# EAGLE design sensor (EAGLE 5.03)
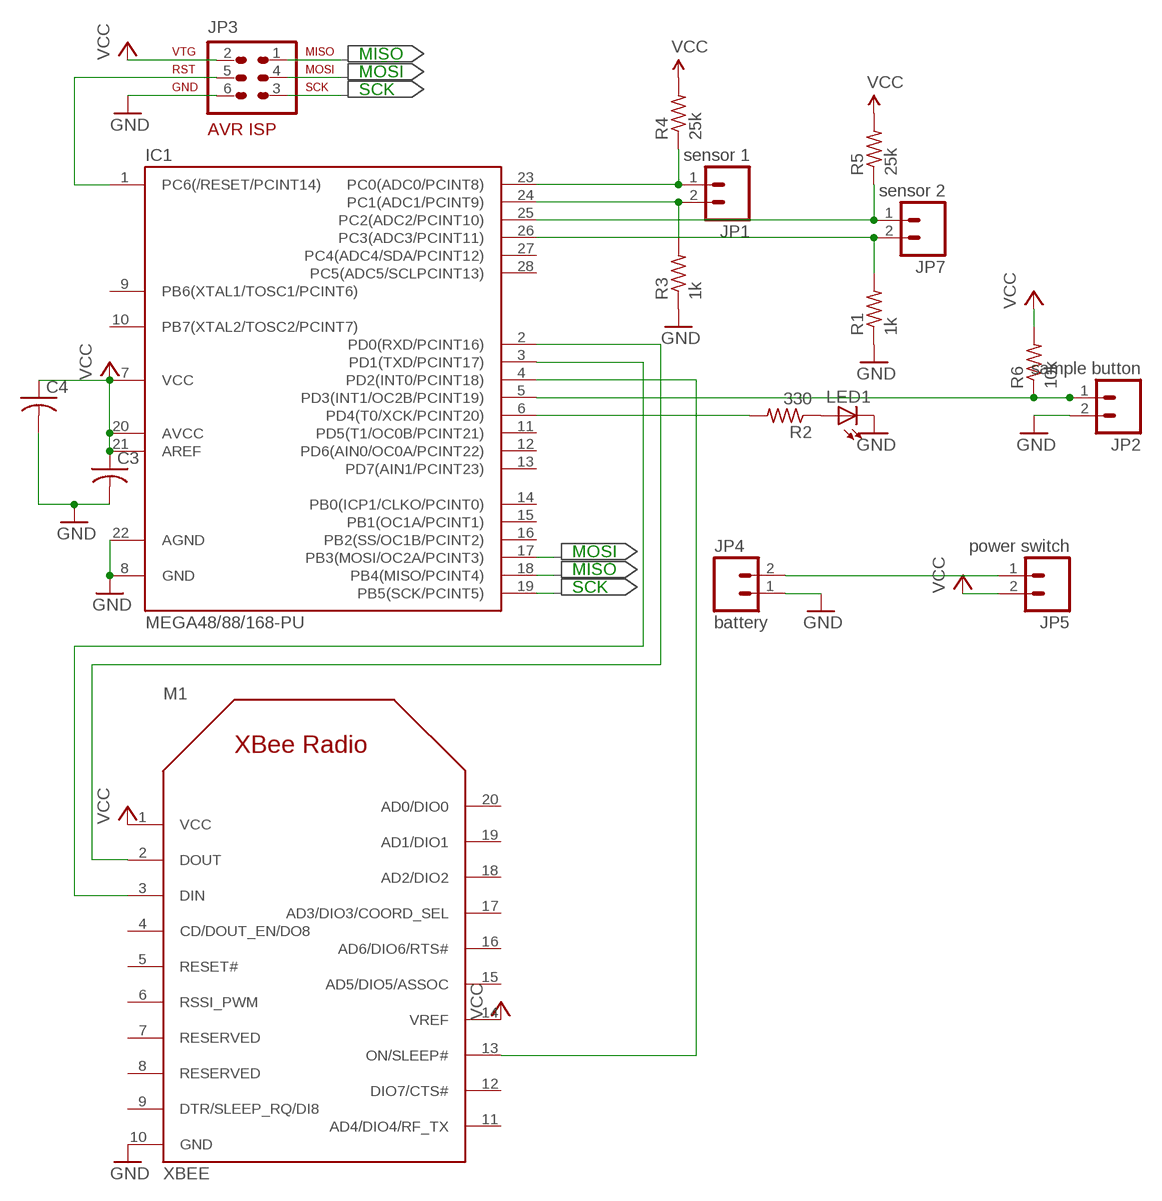
[diagram p0: schematic, sheet 1]

## Parts
C3  C-US025-024X044  [C025-024X044]
C4  C-US025-024X044  [C025-024X044]
IC1  MEGA48/88/168-PU  [DIL28-3]
JP1  sensor 1  M02POLAR  [MOLEX-1X2]
JP2  sample button  M02POLAR  [MOLEX-1X2]
JP3  AVR-ISP-6  [AVR-ISP-6]
JP4  battery  M02POLAR  [MOLEX-1X2]
JP5  power switch  M02POLAR  [MOLEX-1X2]
JP7  sensor 2  M02POLAR  [MOLEX-1X2]
LED1  LED3MM  [LED3MM]
M1  XBEE  [XBEE]
R1  1k  R-US_0204/5  [0204/5]
R2  330  R-US_0204/5  [0204/5]
R3  1k  R-US_0204/5  [0204/5]
R4  25k  R-US_0204/5  [0204/5]
R5  25k  R-US_0204/5  [0204/5]
R6  10k  R-US_0204/5  [0204/5]

## Nets
GND: C3.2 C4.2 IC1.8(GND) IC1.22(AGND) JP2.2 JP3.6 JP4.1 LED1.K(C) M1.10(GND) R1.1 R3.1
MISO: IC1.18(PB4(MISO/PCINT4)) JP3.1
MOSI: IC1.17(PB3(MOSI/OC2A/PCINT3)) JP3.4
N$1: IC1.26(PC3(ADC3/PCINT11)) JP7.2 R1.2
N$2: LED1.A R2.1
N$3: JP4.2 JP5.1
N$4: IC1.24(PC1(ADC1/PCINT9)) JP1.2 R3.2
N$5: IC1.1(PC6(/RESET/PCINT14)) JP3.5
N$6: IC1.2(PD0(RXD/PCINT16)) M1.2(DOUT)
N$7: IC1.3(PD1(TXD/PCINT17)) M1.3(DIN)
N$8: IC1.23(PC0(ADC0/PCINT8)) JP1.1 R4.1
N$9: IC1.25(PC2(ADC2/PCINT10)) JP7.1 R5.1
N$10: IC1.4(PD2(INT0/PCINT18)) M1.13(ON/SLEEP#)
N$11: IC1.5(PD3(INT1/OC2B/PCINT19)) JP2.1 R6.1
N$12: IC1.6(PD4(T0/XCK/PCINT20)) R2.2
SCK: IC1.19(PB5(SCK/PCINT5)) JP3.3
VCC: C3.1 C4.1 IC1.7(VCC) IC1.20(AVCC) IC1.21(AREF) JP3.2 JP5.2 M1.1(VCC) M1.14(VREF) R4.2 R5.2 R6.2
Unconnected: IC1.9(PB6(XTAL1/TOSC1/PCINT6)) IC1.10(PB7(XTAL2/TOSC2/PCINT7)) IC1.11(PD5(T1/OC0B/PCINT21)) IC1.12(PD6(AIN0/OC0A/PCINT22)) IC1.13(PD7(AIN1/PCINT23)) IC1.14(PB0(ICP1/CLKO/PCINT0)) IC1.15(PB1(OC1A/PCINT1)) IC1.16(PB2(SS/OC1B/PCINT2)) IC1.27(PC4(ADC4/SDA/PCINT12)) IC1.28(PC5(ADC5/SCLPCINT13)) M1.4(CD/DOUT_EN/DO8) M1.5(RESET#) M1.6(RSSI_PWM) M1.7(RESERVED) M1.8(RESERVED) M1.9(DTR/SLEEP_RQ/DI8) M1.11(AD4/DIO4/RF_TX) M1.12(DIO7/CTS#) M1.15(AD5/DIO5/ASSOC) M1.16(AD6/DIO6/RTS#) M1.17(AD3/DIO3/COORD_SEL) M1.18(AD2/DIO2) M1.19(AD1/DIO1) M1.20(AD0/DIO0)

## Notes on the sheet
- MISO
- MOSI
- SCK
- MOSI
- MISO
- SCK

## Library data of the parts
C3 C4 = rcl:C-US: CAPACITOR, American symbol
IC1 = avr-4:MEGA48/88/168-PU
JP1 JP2 JP4 JP5 JP7 = SparkFun:M02: Header 2 Standard 2-pin 0.1" header. Use with straight break away headers (SKU : PRT-00116), right angle break away headers (PRT-00553), swiss pins (PRT-00743), machine pins (PRT-00117), and female headers (PRT-00115). Molex polarized connector foot print use with SKU : PRT-08233 with associated crimp pins and housings.
JP3 = atmel:AVR-ISP-6: AVR ISP-6 Serial Programming Header
LED1 = led:LED: LED OSRAM: - CHIPLED LG R971, LG N971, LY N971, LG Q971, LY Q971, LO R971, LY R971 LH N974, LH R974 LS Q976, LO Q976, LY Q976 LO Q996 - Hyper CHIPLED LW Q18S LB Q993, LB Q99A, LB R99A - SideLED LS A670, LO A670, LY A670, LG A670, LP A670 LB A673, LV A673, LT A673, LW A673 LH A674 LY A675 LS A676, LA A676, LO A676, LY A676, LW A676 LS A679, LY A679, LG A679 - Hyper Micro SIDELED® LS Y876, LA Y876, LO Y876, LY Y876 LT Y87S - SmartLED LW L88C, LW L88S LB L89C, LB L89S, LG L890 LS L89K, LO L89K, LY L89K LS L896, LA L896, LO L896, LY L896 - TOPLED LS T670, LO T670, LY T670, LG T670, LP T670 LSG T670, LSP T670, LSY T670, LOP T670, LYG T670 LG T671, LOG T671, LSG T671 LB T673, LV T673, LT T673, LW T673 LH T674 LS T676, LA T676, LO T676, LY T676, LB T676, LH T676, LSB T676, LW T676 LB T67C, LV T67C, LT T67C, LS T67K, LO T67K, LY T67K, LW E67C LS E67B, LA E67B, LO E67B, LY E67B, LB E67C, LV E67C, LT E67C LW T67C LS T679, LY T679, LG T679 LS T770, LO T770, LY T770, LG T770, LP T770 LB T773, LV T773, LT T773, LW T773 LH T774 LS E675, LA E675, LY E675, LS T675 LS T776, LA T776, LO T776, LY T776, LB T776 LHGB T686 LT T68C, LB T68C - Hyper Mini TOPLED® LB M676 - Mini TOPLED Santana® LG M470 LS M47K, LO M47K, LY M47K Source: http://www.osram.convergy.de/
M1 = xbee_r1:XBEE
R1-R6 = rcl:R-US_: RESISTOR, American symbol

## Board
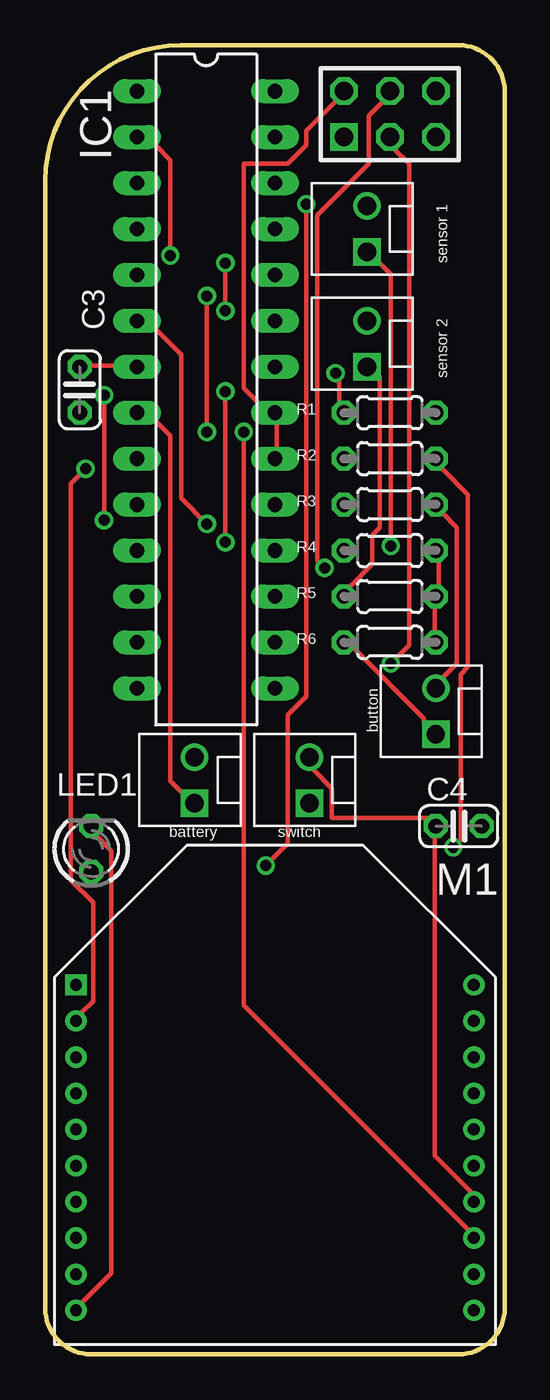
[diagram p1: board, top side]
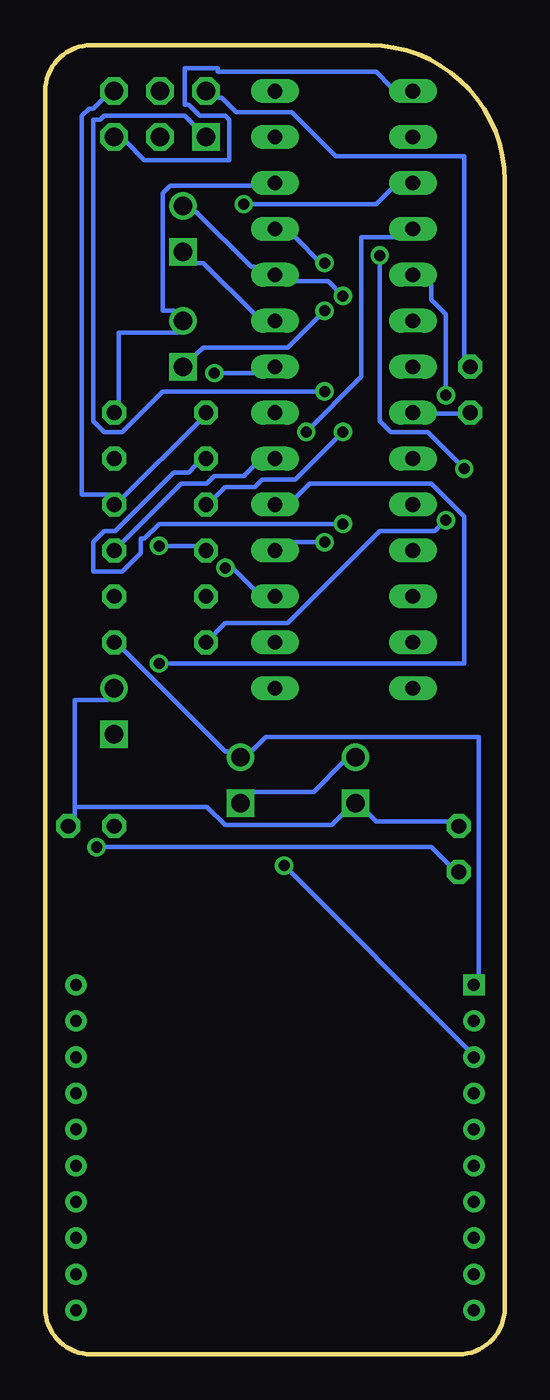
[diagram p2: board, bottom side, seen from below]

Size 25.4 x 72.39 mm. Coordinates in mm from the lower left corner, seen from the top.
Outline: 25.4,69.85 arc90 22.86,72.39 7.5,72.39 arc90 0,64.89 0,2.54 arc90 2.54,0 22.86,0 arc90 25.4,2.54 25.4,69.85
Copper layers (1*16): Top 0.035mm / dielectric 1.5mm / Bottom 0.035mm
Design rules "default": minimum track width 10mil, minimum drill 24mil, track to track 8mil, track to pad 8mil, pad to pad 8mil, via to via 8mil, smd to smd 8mil, copper to edge 40mil, drill to drill 8mil, minimum pad ring 10mil, minimum via ring 8mil, stop-mask expansion 4mil, vias tented up to drill 0mil, thermal gap 10mil

### Footprints (pad centres in the part's own frame; a part is rotated, then mirrored left to right if it is on the bottom)
C025-024X044 = drill 0.813 octagon: 1 -1.27,0; 2 1.27,0
DIL28-3 = drill 0.813 long: 1 -16.51,-3.81; 2 -13.97,-3.81; 3 -11.43,-3.81; 4 -8.89,-3.81; 5 -6.35,-3.81; 6 -3.81,-3.81; 7 -1.27,-3.81; 8 1.27,-3.81; 9 3.81,-3.81; 10 6.35,-3.81; 11 8.89,-3.81; 12 11.43,-3.81; 13 13.97,-3.81; 14 16.51,-3.81; 15 16.51,3.81; 16 13.97,3.81; 17 11.43,3.81; 18 8.89,3.81; 19 6.35,3.81; 20 3.81,3.81; 21 1.27,3.81; 22 -1.27,3.81; 23 -3.81,3.81; 24 -6.35,3.81; 25 -8.89,3.81; 26 -11.43,3.81; 27 -13.97,3.81; 28 -16.51,3.81
MOLEX-1X2 = drill 1.016 square: 1 0,0 | drill 1.016 round: 2 2.54,0
AVR-ISP-6 = drill 1.016 square: 1 -2.54,-1.27 | drill 1.016 octagon: 2 -2.54,1.27; 3 0,-1.27; 4 0,1.27; 5 2.54,-1.27; 6 2.54,1.27
LED3MM = drill 0.813 octagon: A -1.27,0; K 1.27,0
XBEE = drill 0.66 square: 1 -11,9 | drill 0.66 round: 2 -11,7; 3 -11,5; 4 -11,3; 5 -11,1; 6 -11,-1; 7 -11,-3; 8 -11,-5; 9 -11,-7; 10 -11,-9; 11 11,-9; 12 11,-7; 13 11,-5; 14 11,-3; 15 11,-1; 16 11,1; 17 11,3; 18 11,5; 19 11,7; 20 11,9
0204/5 = drill 0.813 octagon: 1 -2.54,0; 2 2.54,0

### Placement (x,y rotation side)
C3  1.91,53.34 270 top
C4  22.86,29.21 0 top
IC1  8.89,53.34 270 top
JP1  17.78,60.96 90 top
JP2  21.59,34.29 90 top
JP3  19.05,68.58 0 top
JP4  8.26,30.48 90 top
JP5  14.61,30.48 90 top
JP7  17.78,54.61 90 top
LED1  2.54,27.94 90 top
M1  12.7,11.43 0 top
R1  19.05,52.07 0 top
R2  19.05,49.53 180 top
R3  19.05,46.99 180 top
R4  19.05,44.45 0 top
R5  19.05,41.91 0 top
R6  19.05,39.37 0 top

### Tracks (layer width: path | path; a pad name or v marks a point on that pad's centre or on a via)
GND  (via drill 0.61)
  Top 0.254: v16.05,54.25 16.26,54.05 16.26,52.63 R1.1 | JP2.2 21.95,37.39 22.76,38.2 22.76,45.72 21.95,46.53 R3.1 | M1.10 2.03,2.85 3.66,4.47 3.66,27.84 2.85,28.65 LED1.K | IC1.8 6.1,51.61 6.91,50.8 6.91,31.7 7.52,31.09 JP4.1
  Bottom 0.254: 23.77,30.28 23.77,36.17 21.95,36.17 JP2.2 | 23.77,30.28 23.77,29.67 C4.2 | R1.1 16.87,51.61 21.13,47.35 R3.1 21.95,47.55 23.37,47.55 23.37,68.48 22.96,68.89 22.76,68.89 22.15,69.49 JP3.6 | v16.05,54.25 13.82,54.25 IC1.22 | C3.2 2.44,52.02 3.86,52.02 IC1.8 | LED1.K 3.05,29.46 7.11,29.46 7.52,29.87 JP4.1 8.94,29.87 9.55,29.26 15.44,29.26 16.46,30.28 23.77,30.28
MISO  (via drill 0.61)
  Top 0.254: v9.96,44.91 v9.96,53.24
  Bottom 0.254: v9.96,44.91 11.58,44.91 IC1.18 | v9.96,53.24 18.9,53.24 21.13,51 22.15,51 22.76,51.61 22.76,68.28 22.35,68.28 22.15,68.48 17.68,68.48 JP3.1
MOSI  (via drill 0.61)
  Top 0.254: v15.44,43.48 15.04,43.89 15.04,62.99 17.88,65.84 17.88,68.48 18.69,69.29 JP3.4
  Bottom 0.254: v15.44,43.48 15.04,43.48 13.82,42.27 IC1.17
N$1
  Bottom 0.254: R1.2 21.34,52.63 21.34,56.49 18.09,56.49 JP7.2 18.29,57.71 18.9,57.71 18.9,64.21 18.49,64.62 13.82,64.62 IC1.26
N$2  (via drill 0.61)
  Top 0.254: v22.55,28.04 22.96,28.45 22.96,37.59 23.37,38 23.37,47.55 21.95,48.97 R2.1
  Bottom 0.254: v22.55,28.04 4.06,28.04 3.05,27.03 LED1.A
N$3
  Bottom 0.254: JP4.2 8.94,32.72 10.57,31.09 14.02,31.09 JP5.1
N$4  (via drill 0.61)
  Top 0.254: v8.94,51 v8.94,58.52
  Bottom 0.254: v8.94,51 11.58,48.36 13.41,48.36 13.82,47.95 15.44,47.95 16.05,47.35 R3.2 | v8.94,58.52 9.75,59.33 11.58,59.33 IC1.24 13.82,60.15 14.02,60.15 17.07,63.2 JP1.2
N$5
  Bottom 0.254: IC1.1 6.3,70.1 7.11,70.92 15.85,70.92 15.85,71.12 17.68,71.12 17.68,69.09 17.48,69.09 16.87,68.48 15.44,68.48 15.24,68.28 15.24,66.04 19.91,66.04 20.93,67.06 JP3.5
N$6  (via drill 0.61)
  Top 0.254: v2.23,48.97 1.42,48.16 1.42,26.21 2.64,24.99 2.64,19.51 2.03,18.9 M1.2 | v6.91,60.76 6.91,66.04 6.1,66.85 IC1.2
  Bottom 0.254: v2.23,48.97 4.27,51 6.3,51 6.91,51.61 v6.91,60.76
N$7  (via drill 0.61)
  Top 0.254: v12.19,27.03 13.41,28.25 13.41,35.36 14.43,36.37 v14.43,63.6
  Bottom 0.254: v12.19,27.03 2.03,16.87 M1.3 | v14.43,63.6 7.11,63.6 6.3,64.41 IC1.3
N$8  (via drill 0.61)
  Top 0.254: v19.1,44.7 19.1,59.74 18.49,60.35 JP1.1
  Bottom 0.254: v19.1,44.7 17.07,44.7 R4.1 | IC1.23 13.82,57.51 16.66,60.35 17.07,60.35 JP1.1
N$9  (via drill 0.61)
  Top 0.254: R5.1 16.87,42.47 18.09,43.69 18.09,45.31 18.49,45.72 18.49,54.05 JP7.1 | v9.96,57.71 v9.96,60.35
  Bottom 0.254: v9.96,60.35 10.16,60.35 11.58,61.77 IC1.25 | v9.96,57.71 11.99,55.68 16.66,55.68 17.07,55.27 JP7.1
N$10  (via drill 0.61)
  Top 0.254: v10.97,51 10.97,19.3 23.37,6.91 M1.13
  Bottom 0.254: v10.97,51 7.92,54.05 7.92,61.77 6.1,61.77 IC1.4
N$11  (via drill 0.61)
  Top 0.254: R6.1 17.07,39.01 20.93,35.15 20.93,34.95 JP2.1 | v3.25,46.13 v3.25,53.03
  Bottom 0.254: v3.25,53.03 3.25,57.51 4.06,58.32 4.06,59.13 IC1.5 | v3.25,46.13 3.86,45.52 6.91,45.52 11.99,40.44 15.44,40.44 R6.1
N$12  (via drill 0.61)
  Top 0.254: v8.94,45.92 7.52,47.35 7.52,55.27 6.1,56.69 IC1.6
  Bottom 0.254: v8.94,45.92 19.1,45.92 19.91,45.11 20.12,45.11 20.12,44.3 21.13,43.28 22.76,43.28 22.76,44.91 22.15,45.52 21.54,45.52 18.29,48.77 17.48,48.77 17.07,49.17 R2.2
SCK  (via drill 0.61)
  Top 0.254: v19.1,38.2 20.12,39.22 20.12,65.84 19.3,66.65 JP3.3
  Bottom 0.254: v19.1,38.2 2.23,38.2 2.23,46.33 4.06,48.16 10.77,48.16 11.58,47.35 IC1.19
VCC
  Top 0.254: C3.1 2.44,54.66 3.86,54.66 IC1.7 | IC1.20 12.8,49.99 12.8,51.61 IC1.21 11.79,52.63 10.97,53.44 10.97,65.84 13.41,65.84 14.43,66.85 14.43,67.67 16.05,69.29 JP3.2 | M1.14 23.57,8.94 21.54,10.97 21.54,28.65 C4.1 21.13,29.67 15.85,29.67 15.85,31.29 14.83,32.31 JP5.2 | R6.2 21.54,39.83 21.54,41.45 R5.2 21.74,42.47 21.74,43.89 R4.2
  Bottom 0.254: C3.1 2.23,55.07 2.23,66.24 9.35,66.24 11.79,68.68 14.83,68.68 15.65,69.49 15.85,69.49 JP3.2 | M1.1 1.42,20.93 1.42,34.14 13.21,34.14 14.02,33.33 JP5.2 15.24,33.33 15.44,33.33 21.13,39.01 R6.2 | IC1.20 13.82,49.17 14.43,48.56 16.05,48.56 16.46,48.16 17.88,48.16 R4.2

### Text on the board
tPlace: sensor 1 | sensor 2 | button | battery | switch
_tNames: IC1 | IC1 | IC1 | JP3 | JP3 | JP3 | C2 | C2 | C2 | C1 | C1 | C1 | JP2 | JP2 | JP2 | R4 | R3 | R3 | R4 | R4 | R3 | R2 | R6 | R5 | S1 | R2 | R2 | R5 | R5 | R1 | R1 | R1 | LED1 | LED1 | LED1 | M1 | M1 | M1 | JP1 | JP1 | JP1
_bNames: BAT1 | BAT1